# Altium project ToasterBigBoardVERSION2.PrjPcb
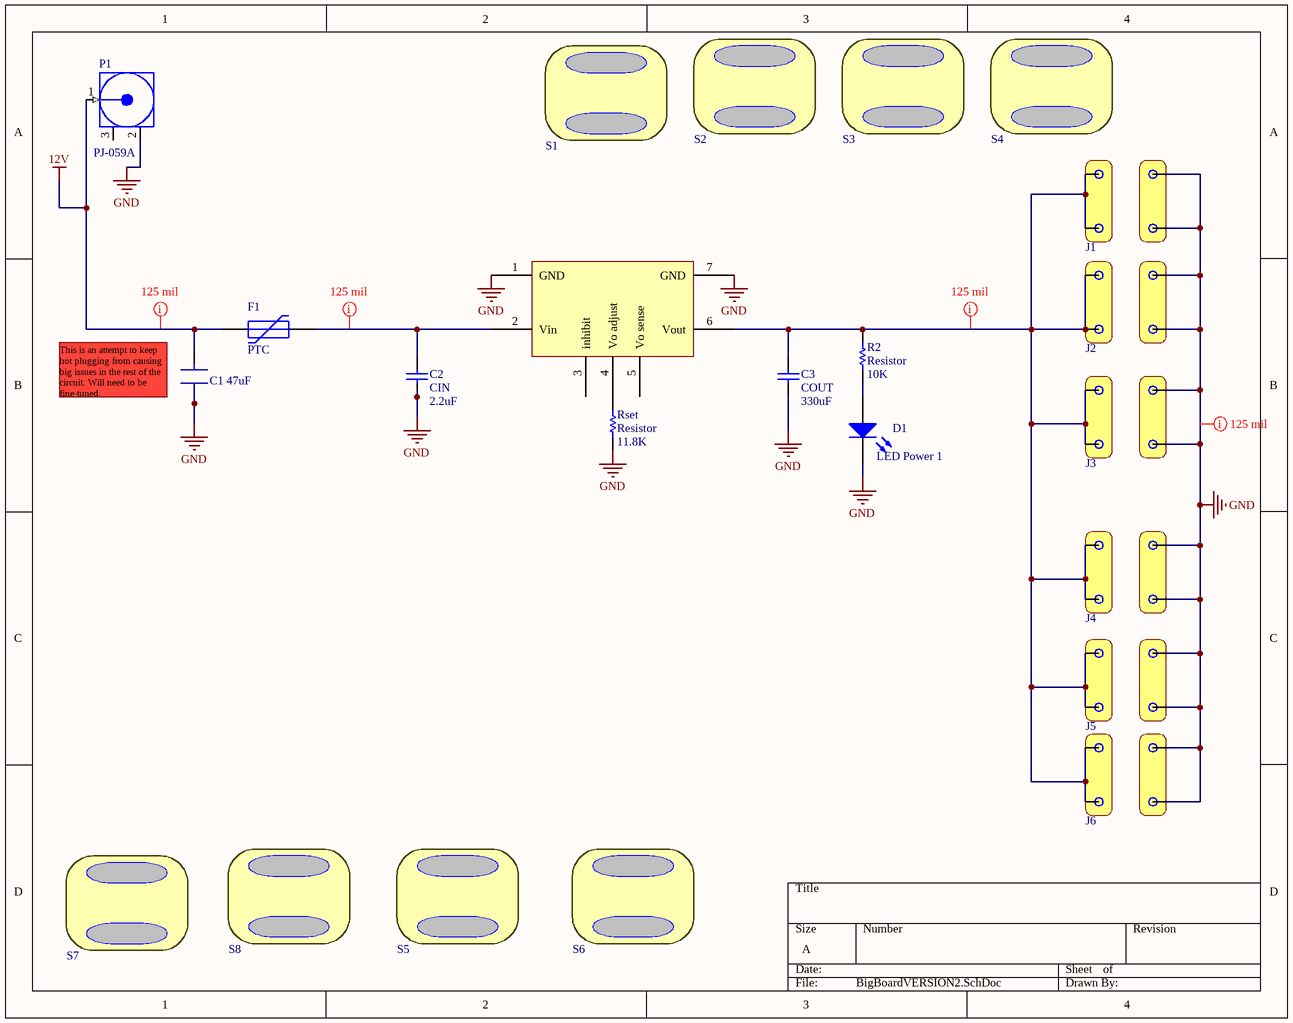
[diagram p0: BigBoardVERSION2.SchDoc]
1 sheet, 23 parts. Net scope: global (net labels, ports and power ports of the same name join across sheets).
Board file: toasterBigBoardVERSION2.PcbDoc

## Sheet BigBoardVERSION2.SchDoc
size A

### Parts
C1_47uF  CapTant6032-28  [CapTant6032-28]  (value not drawn)
C2  CIN  value 2.2uF  [CAPC2012L]
C3  COUT  value 330uF  [RAD-0.2 - POLARIZED]
D1  LED Power 1  [SurfaceMount(603)]
F1  PTC  [J1-1812]
J1  ToasterChargerProng  [ToasterChargerProng]  (value not drawn)
J2  ToasterChargerProng  [ToasterChargerProng]  (value not drawn)
J3  ToasterChargerProng  [ToasterChargerProng]  (value not drawn)
J4  ToasterChargerProng  [ToasterChargerProng]  (value not drawn)
J5  ToasterChargerProng  [ToasterChargerProng]  (value not drawn)
J6  ToasterChargerProng  [ToasterChargerProng]  (value not drawn)
P1  PJ-059A  [PJ-059A]
R2  Resistor  value 10K  [J1-0603]
Rset  Resistor  value 11.8K  [J1-0603]
S1  ToasterChargerZiptie  [TOASTERCHARGERZIPTIEREVISED2]  (value not drawn)
S2  ToasterChargerZiptie  [TOASTERCHARGERZIPTIEREVISED2]  (value not drawn)
S3  ToasterChargerZiptie  [TOASTERCHARGERZIPTIEREVISED2]  (value not drawn)
S4  ToasterChargerZiptie  [TOASTERCHARGERZIPTIEREVISED2]  (value not drawn)
S5  ToasterChargerZiptie  [TOASTERCHARGERZIPTIEREVISED2]  (value not drawn)
S6  ToasterChargerZiptie  [TOASTERCHARGERZIPTIEREVISED2]  (value not drawn)
S7  ToasterChargerZiptie  [TOASTERCHARGERZIPTIEREVISED2]  (value not drawn)
S8  ToasterChargerZiptie  [TOASTERCHARGERZIPTIEREVISED2]  (value not drawn)
  PTN78020WAH  [PTN78020WAH]  (value not drawn)

### Nets
12V: C1_47uF.1 F1.1 P1.1(VCC)
GND: C1_47uF.2 C2.1 C3.1 D1.2(K) J1.3 J1.4 J2.3 J2.4 J3.3 J3.4 J4.3 J4.4 J5.3 J5.4 J6.3 J6.4 P1.2(GND) Rset.2 .1(GND) .7(GND)
NetC2_2: C2.2 F1.2 .2(Vin)
NetC3_2: C3.2 J1.1 J1.2 J2.1 J2.2 J3.1 J3.2 J4.1 J4.2 J5.1 J5.2 J6.1 J6.2 R2.1 .6(Vout)
NetD1_1: D1.1(A) R2.2
NetRset_1: Rset.1 .4(Vo_adjust)

Not connected (* = marked no-connect by the designer): P1 3;  3(inhibit) 5(Vo_sense)

### Layout directives
rule Width Constraint [Pref Width = 125mil    Min Width = 20mil    Max Width = 250mil]: 12V, GND, NetC2_2, NetC3_2

### Notes on the sheet
- (near C1_47uF) This is an attempt to keep hot plugging from causing big issues in the rest of the circuit. Will need to be fine-tuned.

### Library data of the parts
C1_47uF = CapTant6032-28: Polarized Tantalum Capacitor for use in Toaster Charger
C2 C3 = Cap: Capacitor; Published: 8-Jun-2000; LatestRevisionDate: 17-Jul-2002; LatestRevisionNote: Re-released for DXP Platform.; PackageReference: RAD-0.3; Publisher: Altium Limited
D1 = LED
F1 = PTC_FUSE: Fuse; Published: 8-Jun-2000; LatestRevisionDate: 17-Jul-2002; LatestRevisionNote: Re-released for DXP Platform.; PackageReference: PIN-W2/E2.8; Publisher: Altium Limited
J1-J6 = ToasterChargerProng: Charger Prong Footprint for Toaster Charger; Published: 24-Mar-1999; LatestRevisionDate: 17-Jul-2002; LatestRevisionNote: Re-released for DXP Platform.; PackageReference: RAD-0.2; Publisher: Altium Limited
S1-S8 = ToasterChargerZiptie: Slot for Ziptie connection between PCB and Toaster Charger
R2 Rset = Resistor: Published: 8-Jun-2000; LatestRevisionDate: 17-Jul-2002; LatestRevisionNote: Re-released for DXP Platform.; PackageReference: AXIAL-0.3; Publisher: Altium Limited; PackageDescription: Axial Device, Thru-Hole; 2 Leads; 0.3 in Pin Spacing
 = PTN78020WAH: T.I. DC-DC Converter